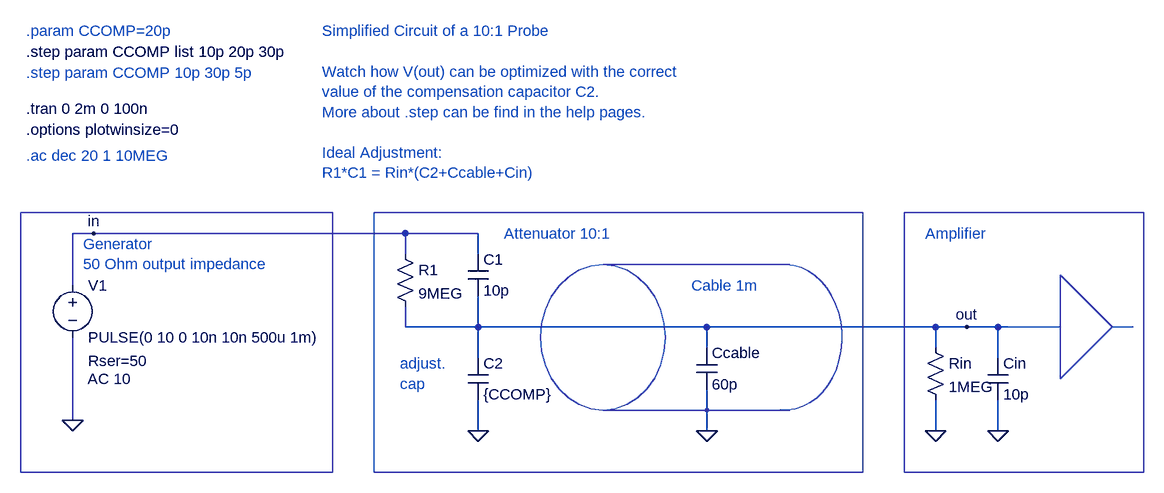
[diagram p0: schematic 10_1_Probe_simple.asc]
10_1_Probe_simple.asc, the LTspice schematic file:
Version 4
SHEET 1 1908 680
WIRE -96 144 -96 64
WIRE -96 352 -96 224
WIRE -64 64 -96 64
WIRE 416 64 -64 64
WIRE 416 96 416 64
WIRE 416 208 416 176
WIRE 528 64 416 64
WIRE 528 96 528 64
WIRE 528 208 416 208
WIRE 528 208 528 160
WIRE 528 256 528 208
WIRE 528 368 528 320
WIRE 880 208 528 208
WIRE 880 240 880 208
WIRE 880 368 880 304
WIRE 1232 208 880 208
WIRE 1232 240 1232 208
WIRE 1232 368 1232 320
WIRE 1280 208 1232 208
WIRE 1328 208 1280 208
WIRE 1328 256 1328 208
WIRE 1328 368 1328 320
WIRE 1344 208 1328 208
FLAG -96 352 0
FLAG 528 368 0
FLAG 880 368 0
FLAG 1232 368 0
FLAG 1328 368 0
FLAG 1280 208 out
FLAG -64 64 in
SYMBOL voltage -96 128 R0
WINDOW 123 23 160 Left 0
WINDOW 39 24 132 Left 0
SYMATTR Value2 AC 10
SYMATTR SpiceLine Rser=50
SYMATTR InstName V1
SYMATTR Value PULSE(0 10 0 10n 10n 500u 1m)
SYMBOL res 400 80 R0
SYMATTR InstName R1
SYMATTR Value 9MEG
SYMBOL cap 512 96 R0
SYMATTR InstName C1
SYMATTR Value 10p
SYMBOL cap 864 240 R0
SYMATTR InstName Ccable
SYMATTR Value 60p
SYMBOL res 1216 224 R0
SYMATTR InstName Rin
SYMATTR Value 1MEG
SYMBOL cap 1312 256 R0
SYMATTR InstName Cin
SYMATTR Value 10p
SYMBOL cap 512 256 R0
SYMATTR InstName C2
SYMATTR Value {CCOMP}
TEXT -168 -216 Left 0 !.step param CCOMP list 10p 20p 30p
TEXT -168 -128 Left 0 !.tran 0 2m 0 100n
TEXT -168 -96 Left 0 !.options plotwinsize=0
TEXT 568 64 Left 0 ;Attenuator 10:1
TEXT 1216 64 Left 0 ;Amplifier
TEXT 856 144 Left 0 ;Cable 1m
TEXT 408 264 Left 0 ;adjust. \ncap
TEXT 288 -248 Left 0 ;Simplified Circuit of a 10:1 Probe\n \nWatch how V(out) can be optimized with the correct \nvalue of the compensation capacitor C2.\nMore about .step can be find in the help pages.\n \nIdeal Adjustment: \nR1*C1 = Rin*(C2+Ccable+Cin)
TEXT -80 80 Left 0 ;Generator \n50 Ohm output impedance
TEXT -168 -248 Left 0 ;.param CCOMP=20p
TEXT -168 -184 Left 0 ;.step param CCOMP 10p 30p 5p
TEXT -168 -56 Left 0 ;.ac dec 20 1 10MEG
LINE Normal 1008 112 720 112
LINE Normal 1008 336 720 336
LINE Normal 1424 288 1424 128
LINE Normal 1504 208 1424 288
LINE Normal 1424 128 1504 208
LINE Normal 1424 208 1344 208
LINE Normal 1536 208 1504 208
RECTANGLE Normal 304 432 -176 32
RECTANGLE Normal 1120 432 368 32
RECTANGLE Normal 1552 432 1184 32
RECTANGLE Normal 880 336 880 336
RECTANGLE Normal 896 336 880 336
RECTANGLE Normal 882 338 878 334
CIRCLE Normal 816 336 624 112
ARC Normal 912 112 1088 336 986 431 1002 111

The netlist it stands for:
* 10_1_Probe_simple.asc
V1 in 0 PULSE(0 10 0 10n 10n 500u 1m) AC 10 Rser=50
R1 in out 9MEG
C1 in out 10p
Ccable out 0 60p
Rin out 0 1MEG
Cin out 0 10p
C2 out 0 {CCOMP}
.step param CCOMP list 10p 20p 30p
.tran 0 2m 0 100n
.options plotwinsize=0
* Attenuator 10:1
* Amplifier
* Cable 1m
* adjust.
* cap
* Simplified Circuit of a 10:1 Probe
* Watch how V(out) can be optimized with the correct
* value of the compensation capacitor C2.
* More about .step can be find in the help pages.
* Ideal Adjustment:
* R1*C1 = Rin*(C2+Ccable+Cin)
* Generator
* 50 Ohm output impedance
* .param CCOMP=20p
* .step param CCOMP 10p 30p 5p
* .ac dec 20 1 10MEG
.backanno
.end